# Altium schematic sheet EEPROM.SchDoc
size A4
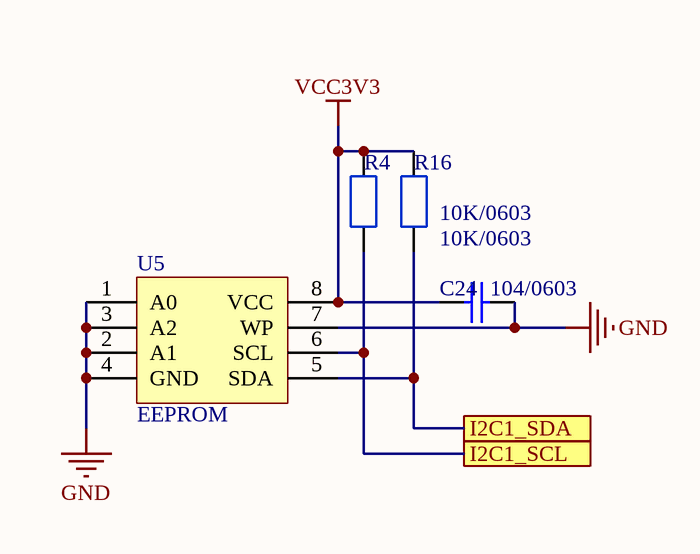
[diagram p0: EEPROM.SchDoc]

## Parts
C24  104/0603  [C0603]
R4  10K/0603  [R0603]
R16  10K/0603  [R0603]
U5  EEPROM  [SOP8]

## Ports
I2C1_SCL, I2C1_SDA

## Nets
GND: C24.2 U5.1(A0) U5.2(A1) U5.3(A2) U5.4(GND) U5.7(WP)
VCC3V3: C24.1 R4.2 R16.2 U5.8(VCC)
I2C1_SCL: R4.1 U5.6(SCL) ; port I2C1_SCL
I2C1_SDA: R16.1 U5.5(SDA) ; port I2C1_SDA

## Library data of the parts
C24 = CAP: 无极性贴片电容
R4 R16 = RES
U5 = 24CXX